# EAGLE schematic Stepoko (EAGLE 6.5.0)

## Sheet 1 of 2
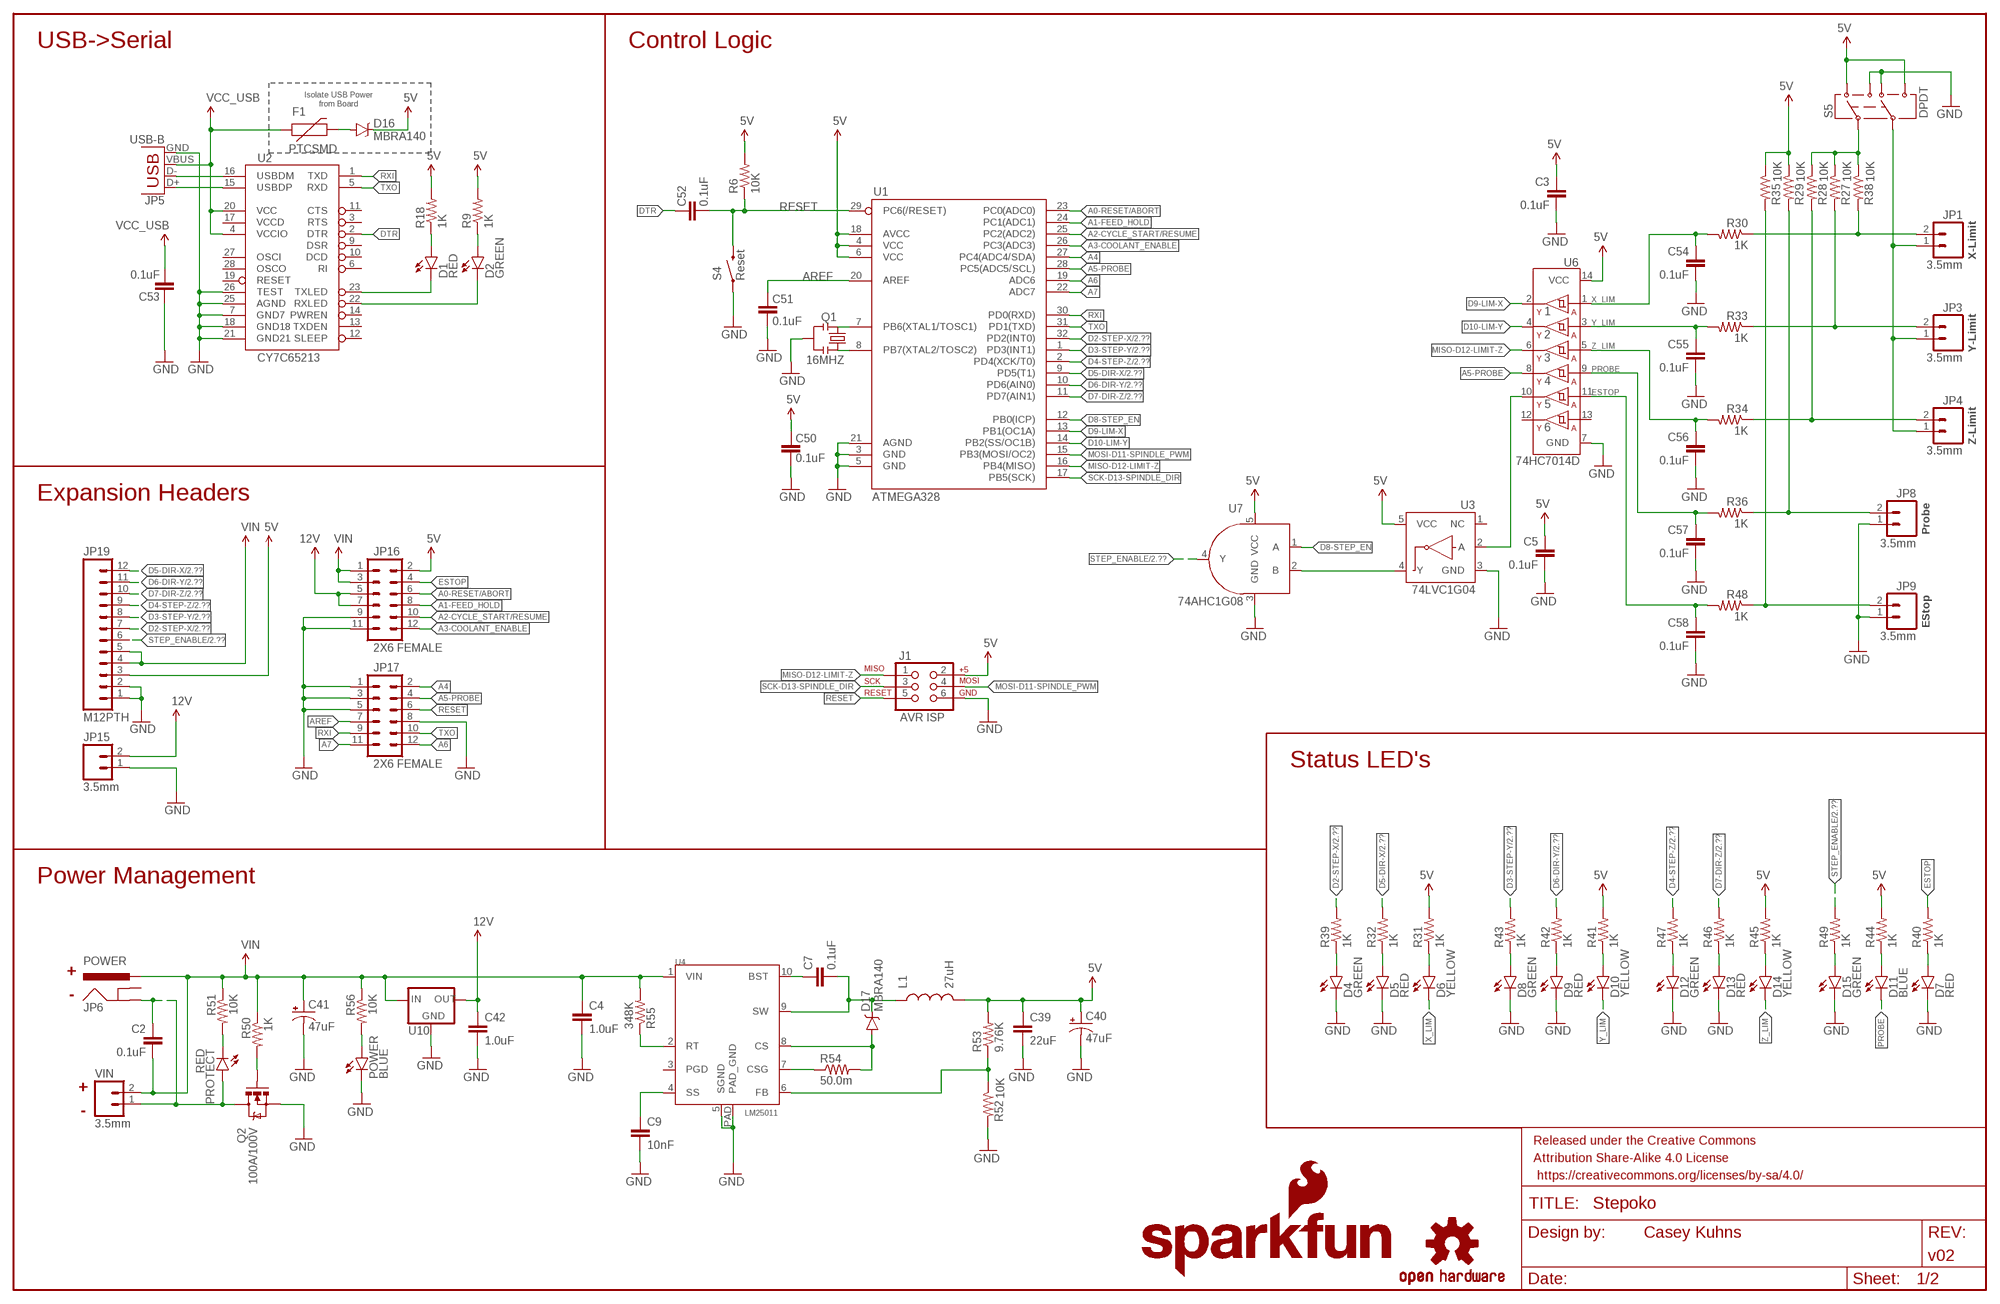
[diagram p0: schematic, sheet 1]

### Parts
C2  0.1uF  0.1UF-100V-10%(0603)  [0603-CAP]
C3  0.1uF  0.1UF-25V(+80/-20%)(0603)  [0603-CAP]
C4  1.0uF  1.0UF50V10%(1206)  [1206]
C5  0.1uF  0.1UF-25V(+80/-20%)(0603)  [0603-CAP]
C7  0.1uF  0.1UF-25V(+80/-20%)(0603)  [0603-CAP]
C9  10nF  10NF/10000PF-50V-10%(0603)  [0603-CAP]
C39  22uF  22UF-16V-20%-(1210)  [1210]
C40  47uF  47UF-50V-20%(ELECT)  [PANASONIC_D]
C41  47uF  47UF-50V-20%(ELECT)  [PANASONIC_D]
C42  1.0uF  1.0UF50V10%(1206)  [1206]
C50  0.1uF  0.1UF-25V(+80/-20%)(0603)  [0603-CAP]
C51  0.1uF  0.1UF-25V(+80/-20%)(0603)  [0603-CAP]
C52  0.1uF  0.1UF-25V(+80/-20%)(0603)  [0603-CAP]
C53  0.1uF  0.1UF-25V(+80/-20%)(0603)  [0603-CAP]
C54  0.1uF  0.1UF-25V(+80/-20%)(0603)  [0603-CAP]
C55  0.1uF  0.1UF-25V(+80/-20%)(0603)  [0603-CAP]
C56  0.1uF  0.1UF-25V(+80/-20%)(0603)  [0603-CAP]
C57  0.1uF  0.1UF-25V(+80/-20%)(0603)  [0603-CAP]
C58  0.1uF  0.1UF-25V(+80/-20%)(0603)  [0603-CAP]
D1  RED  LED-REDLILYPAD  [LED-1206]
D2  GREEN  LED-GREENLILYPAD  [LED-1206]
D4  GREEN  LED-GREENLILYPAD  [LED-1206]
D5  RED  LED-REDLILYPAD  [LED-1206]
D6  YELLOW  LED-YELLOWLILYPAD  [LED-1206]
D7  RED  LED-REDLILYPAD  [LED-1206]
D8  GREEN  LED-GREENLILYPAD  [LED-1206]
D9  RED  LED-REDLILYPAD  [LED-1206]
D10  YELLOW  LED-YELLOWLILYPAD  [LED-1206]
D11  BLUE  LED-BLUE1206  [LED-1206]
D12  GREEN  LED-GREENLILYPAD  [LED-1206]
D13  RED  LED-REDLILYPAD  [LED-1206]
D14  YELLOW  LED-YELLOWLILYPAD  [LED-1206]
D15  GREEN  LED-GREENLILYPAD  [LED-1206]
D16  MBRA140  DIODE-SCHOTTKY-MBRA140  [SMA-DIODE]
D17  MBRA140  DIODE-SCHOTTKY-MBRA140  [SMA-DIODE]
F1  PTCSMD  [PTC-1206]
FRAME1  FRAME-LEDGER  [CREATIVE_COMMONS]
J1  AVR ISP  AVR_SPI_PRG_6PTH  [2X3]
JP1  3.5mm  M023.5MM_LOCK  [SCREWTERMINAL-3.5MM-2_LOCK]
JP3  3.5mm  M023.5MM_LOCK  [SCREWTERMINAL-3.5MM-2_LOCK]
JP4  3.5mm  M023.5MM_LOCK  [SCREWTERMINAL-3.5MM-2_LOCK]
JP5  USB-B  USBPTH  [USB-B-PTH]
JP6  POWER  POWER_JACKPTH_LOCK  [POWER_JACK_PTH_LOCK]
JP8  3.5mm  M023.5MM_LOCK  [SCREWTERMINAL-3.5MM-2_LOCK]
JP9  3.5mm  M023.5MM_LOCK  [SCREWTERMINAL-3.5MM-2_LOCK]
JP15  3.5mm  M023.5MM_LOCK  [SCREWTERMINAL-3.5MM-2_LOCK]
JP16  2X6 FEMALE  M06X2PTH_FEMALE  [2X6]
JP17  2X6 FEMALE  M06X2PTH_FEMALE  [2X6]
JP19  M12PTH  [1X12]
L1  27uH  INDUCTORSDR13-7-270ML  [INDUCTOR_SDR1307]
LOGO1  OSHW-LOGOM  [OSHW-LOGO-M]
LOGO2  SFE_LOGO_NAME_FLAME.2_INCH  [SFE_LOGO_NAME_FLAME_.2]
POWER  BLUE  LED-BLUE1206  [LED-1206]
PROTECT  RED  LED-REDLILYPAD  [LED-1206]
Q1  16MHZ  RESONATOR16MHZ  [RESONATOR-SMD]
Q2  100A/100V  MOSFET-NCHANNELPSMN7R0  [TO-263/D2PAK]
R6  10K  10KOHM-1/10W-1%(0603)0603  [0603-RES]
R9  1K  1KOHM1/10W1%(0603)  [0603-RES]
R18  1K  1KOHM1/10W1%(0603)  [0603-RES]
R27  10K  10KOHM-1/10W-1%(0603)0603  [0603-RES]
R28  10K  10KOHM-1/10W-1%(0603)0603  [0603-RES]
R29  10K  10KOHM-1/10W-1%(0603)0603  [0603-RES]
R30  1K  1KOHM1/10W1%(0603)  [0603-RES]
R31  1K  1KOHM-1/10W-1%(0603)  [0603-RES]
R32  1K  1KOHM-1/10W-1%(0603)  [0603-RES]
R33  1K  1KOHM1/10W1%(0603)  [0603-RES]
R34  1K  1KOHM1/10W1%(0603)  [0603-RES]
R35  10K  10KOHM-1/10W-1%(0603)0603  [0603-RES]
R36  1K  1KOHM1/10W1%(0603)  [0603-RES]
R38  10K  10KOHM-1/10W-1%(0603)0603  [0603-RES]
R39  1K  1KOHM-1/10W-1%(0603)  [0603-RES]
R40  1K  1KOHM-1/10W-1%(0603)  [0603-RES]
R41  1K  1KOHM-1/10W-1%(0603)  [0603-RES]
R42  1K  1KOHM-1/10W-1%(0603)  [0603-RES]
R43  1K  1KOHM-1/10W-1%(0603)  [0603-RES]
R44  1K  1KOHM-1/10W-1%(0603)  [0603-RES]
R45  1K  1KOHM-1/10W-1%(0603)  [0603-RES]
R46  1K  1KOHM-1/10W-1%(0603)  [0603-RES]
R47  1K  1KOHM-1/10W-1%(0603)  [0603-RES]
R48  1K  1KOHM1/10W1%(0603)  [0603-RES]
R49  1K  1KOHM-1/10W-1%(0603)  [0603-RES]
R50  1K  1KOHM1/10W1%(0603)  [0603-RES]
R51  10K  10KOHM-1/10W-1%(0603)0603  [0603-RES]
R52  10K  10KOHM-1/10W-1%(0603)0603  [0603-RES]
R53  9.76K  9.76KOHM-1/10W-1%(0603)  [0603]
R54  50.0m  0.05OHM-1/5W-1%(0603)  [0603]
R55  348K  348KOHM-1/10W-1%(0603)  [0603]
R56  10K  10KOHM-1/10W-1%(0603)0603  [0603-RES]
S4  Reset  SWITCH-MOMENTARY-2SMD  [TACTILE-SWITCH-SMD]
S5  DPDT  SWITCH-DPDTAYZ0202  [AYZ0202]
U1  ATMEGA328  ATMEGA328_SMT  [TQFP32-08]
U2  CY7C65213  [SSOP28DB]
U3  74LVC1G04  INVERTER_SOT353-5  [SOT353]
U4  LM25011  [HVSS0P-10]
U6  74HC7014D  [SOIC-14]
U7  74AHC1G08  [SOT23-5]
U10  V_REG_78XX7812  [TO-252]
VIN  3.5mm  M023.5MM_LOCK  [SCREWTERMINAL-3.5MM-2_LOCK]

### Nets
5V: C3.1 C5.1 C39.1 C40.+ C50.2 D16.C J1.2 JP16.2 JP19.3 L1.P$2 R6.2 R9.2 R18.2 R29.1 R31.2 R35.1 R41.2 R44.2 R45.2 R53.2 S5.1 S5.6 U1.4(VCC) U1.6(VCC) U1.18(AVCC) U3.5(VCC) U6.14(VCC) U7.5(VCC) ; also sheet 2
A0-RESET/ABORT: JP16.6 U1.23(PC0(ADC0))
A1-FEED_HOLD: JP16.8 U1.24(PC1(ADC1))
A2-CYCLE_START/RESUME: JP16.10 U1.25(PC2(ADC2))
A3-COOLANT_ENABLE: JP16.12 U1.26(PC3(ADC3))
A4: JP17.2 U1.27(PC4(ADC4/SDA))
A5-PROBE: JP17.4 U1.28(PC5(ADC5/SCL)) U6.8(4Y)
A6: JP17.12 U1.19(ADC6)
A7: JP17.11 U1.22(ADC7)
AREF: C51.2 JP17.7 U1.20(AREF)
D2-STEP-X: JP19.7 R39.2 U1.32(PD2(INT0)) ; also sheet 2
D3-STEP-Y: JP19.8 R43.2 U1.1(PD3(INT1)) ; also sheet 2
D4-STEP-Z: JP19.9 R47.2 U1.2(PD4(XCK/T0)) ; also sheet 2
D5-DIR-X: JP19.12 R32.2 U1.9(PD5(T1)) ; also sheet 2
D6-DIR-Y: JP19.11 R42.2 U1.10(PD6(AIN0)) ; also sheet 2
D7-DIR-Z: JP19.10 R46.2 U1.11(PD7(AIN1)) ; also sheet 2
D8-STEP_EN: U1.12(PB0(ICP)) U7.1(A)
D9-LIM-X: U1.13(PB1(OC1A)) U6.2(1Y)
D10-LIM-Y: U1.14(PB2(SS/OC1B)) U6.4(2Y)
D+: JP5.D+ U2.15(USBDP)
D-: JP5.D- U2.16(USBDM)
DTR: C52.2 U2.2(DTR)
ESTOP: C58.1 JP16.4 R40.2 R48.2 U6.11(5A)
GND: C3.2 C4.2 C5.2 C9.2 C39.2 C40.- C41.- C42.2 C50.1 C51.1 C53.2 C54.2 C55.2 C56.2 C57.2 C58.2 D4.C D5.C D7.C D8.C D9.C D12.C D13.C D15.C J1.6 JP5.GND JP8.1 JP9.1 JP15.1 JP16.9 JP16.11 JP17.1 JP17.3 JP17.5 JP17.8 JP19.1 JP19.2 POWER.C Q1.2 Q2.3(S) R52.2 S4.1 S5.3 S5.4 U1.3(GND) U1.5(GND) U1.21(AGND) U2.7(GND7) U2.18(GND18) U2.21(GND21) U2.25(AGND) U2.26(TEST) U3.3(GND) U4.5(SGND) U4.PAD(PAD_GND) U6.7(GND) U7.3(GND) U10.3(GND) ; also sheet 2
MISO-D12-LIMIT-Z: J1.1 U1.16(PB4(MISO)) U6.6(3Y)
MOSI-D11-SPINDLE_PWM: J1.4 U1.15(PB3(MOSI/OC2))
N$1: R54.1 U4.7(CSG)
N$2: D2.A R9.1
N$3: D1.A R18.1
N$4: JP1.1 JP3.1 JP4.1 S5.5
N$5: D7.A R40.1
N$6: Q1.3 U1.8(PB7(XTAL2/TOSC2))
N$7: JP1.2 R30.1 R38.2
N$8: Q1.1 U1.7(PB6(XTAL1/TOSC1))
N$13: D11.A R44.1
N$16: D15.A R49.1
N$17: C2.1 JP6.GND PROTECT.A Q2.2(D) VIN.1
N$18: D6.A R31.1
N$19: D5.A R32.1
N$20: D4.A R39.1
N$21: R52.1 R53.1 U4.6(FB)
N$22: D10.A R41.1
N$31: D9.A R42.1
N$32: D1.C U2.23(TXLED)
N$33: D2.C U2.22(RXLED)
N$36: D8.A R43.1
N$39: Q2.1(G) R50.2
N$40: D14.A R45.1
N$41: PROTECT.C R51.2
N$42: JP3.2 R27.2 R33.1
N$43: JP4.2 R28.2 R34.1
N$44: U3.4(Y) U7.2(B)
N$51: D16.A F1.2
N$52: U3.2(A) U6.10(5Y)
N$53: JP8.2 R29.2 R36.1
N$57: JP9.2 R35.2 R48.1
N$62: POWER.A R56.2
N$63: D13.A R46.1
N$64: D12.A R47.1
N$65: D17.A R54.2 U4.8(CS)
N$66: R55.1 U4.2(RT)
N$68: C7.1 U4.10(BST)
N$70: C7.2 D17.C L1.P$1 U4.9(SW)
N$78: C9.1 U4.4(SS)
N$95: R27.1 R28.1 R38.1 S5.2
PROBE: C57.1 D11.C R36.2 U6.9(4A)
RESET: C52.1 J1.5 JP17.6 R6.1 S4.3 U1.29(PC6(/RESET))
RXI: JP17.9 U1.30(PD0(RXD)) U2.1(TXD)
SCK-D13-SPINDLE_DIR: J1.3 U1.17(PB5(SCK))
STEP_ENABLE: JP19.6 R49.2 U7.4(Y) ; also sheet 2
TXO: JP17.10 U1.31(PD1(TXD)) U2.5(RXD)
VCC: C42.1 JP15.2 JP16.5 JP16.7 U10.2(OUT) ; supply symbol labelled 12V
VCC_USB: C53.1 F1.1 JP5.VBUS U2.4(VCCIO) U2.20(VCC)
VIN: C2.2 C4.1 C41.+ JP6.PWR JP16.1 JP16.3 JP19.4 JP19.5 R50.1 R51.1 R55.2 R56.1 U4.1(VIN) U10.1(IN) VIN.2 ; also sheet 2
X_LIM: C54.1 D6.C R30.2 U6.1(1A)
Y_LIM: C55.1 D10.C R33.2 U6.3(2A)
Z_LIM: C56.1 D14.C R34.2 U6.5(3A)
Unconnected: JP6.GNDBREAK U2.3(RTS) U2.6(RI) U2.9(DSR) U2.10(DCD) U2.11(CTS) U2.12(SLEEP) U2.13(TXDEN) U2.14(PWREN) U2.17(VCCD) U2.19(RESET) U2.27(OSCI) U2.28(OSCO) U3.1(NC) U4.3(PGD) U6.12(6Y) U6.13(6A)

### Notes on the sheet
- USB->Serial | Control Logic
- Isolate USB Power
  from Board
- X-Limit
- Y-Limit
- Z-Limit
- Expansion Headers
- Probe
- EStop
- Status LED's
- Power Management
- +
- -
- +
- -

## Sheet 2 of 2
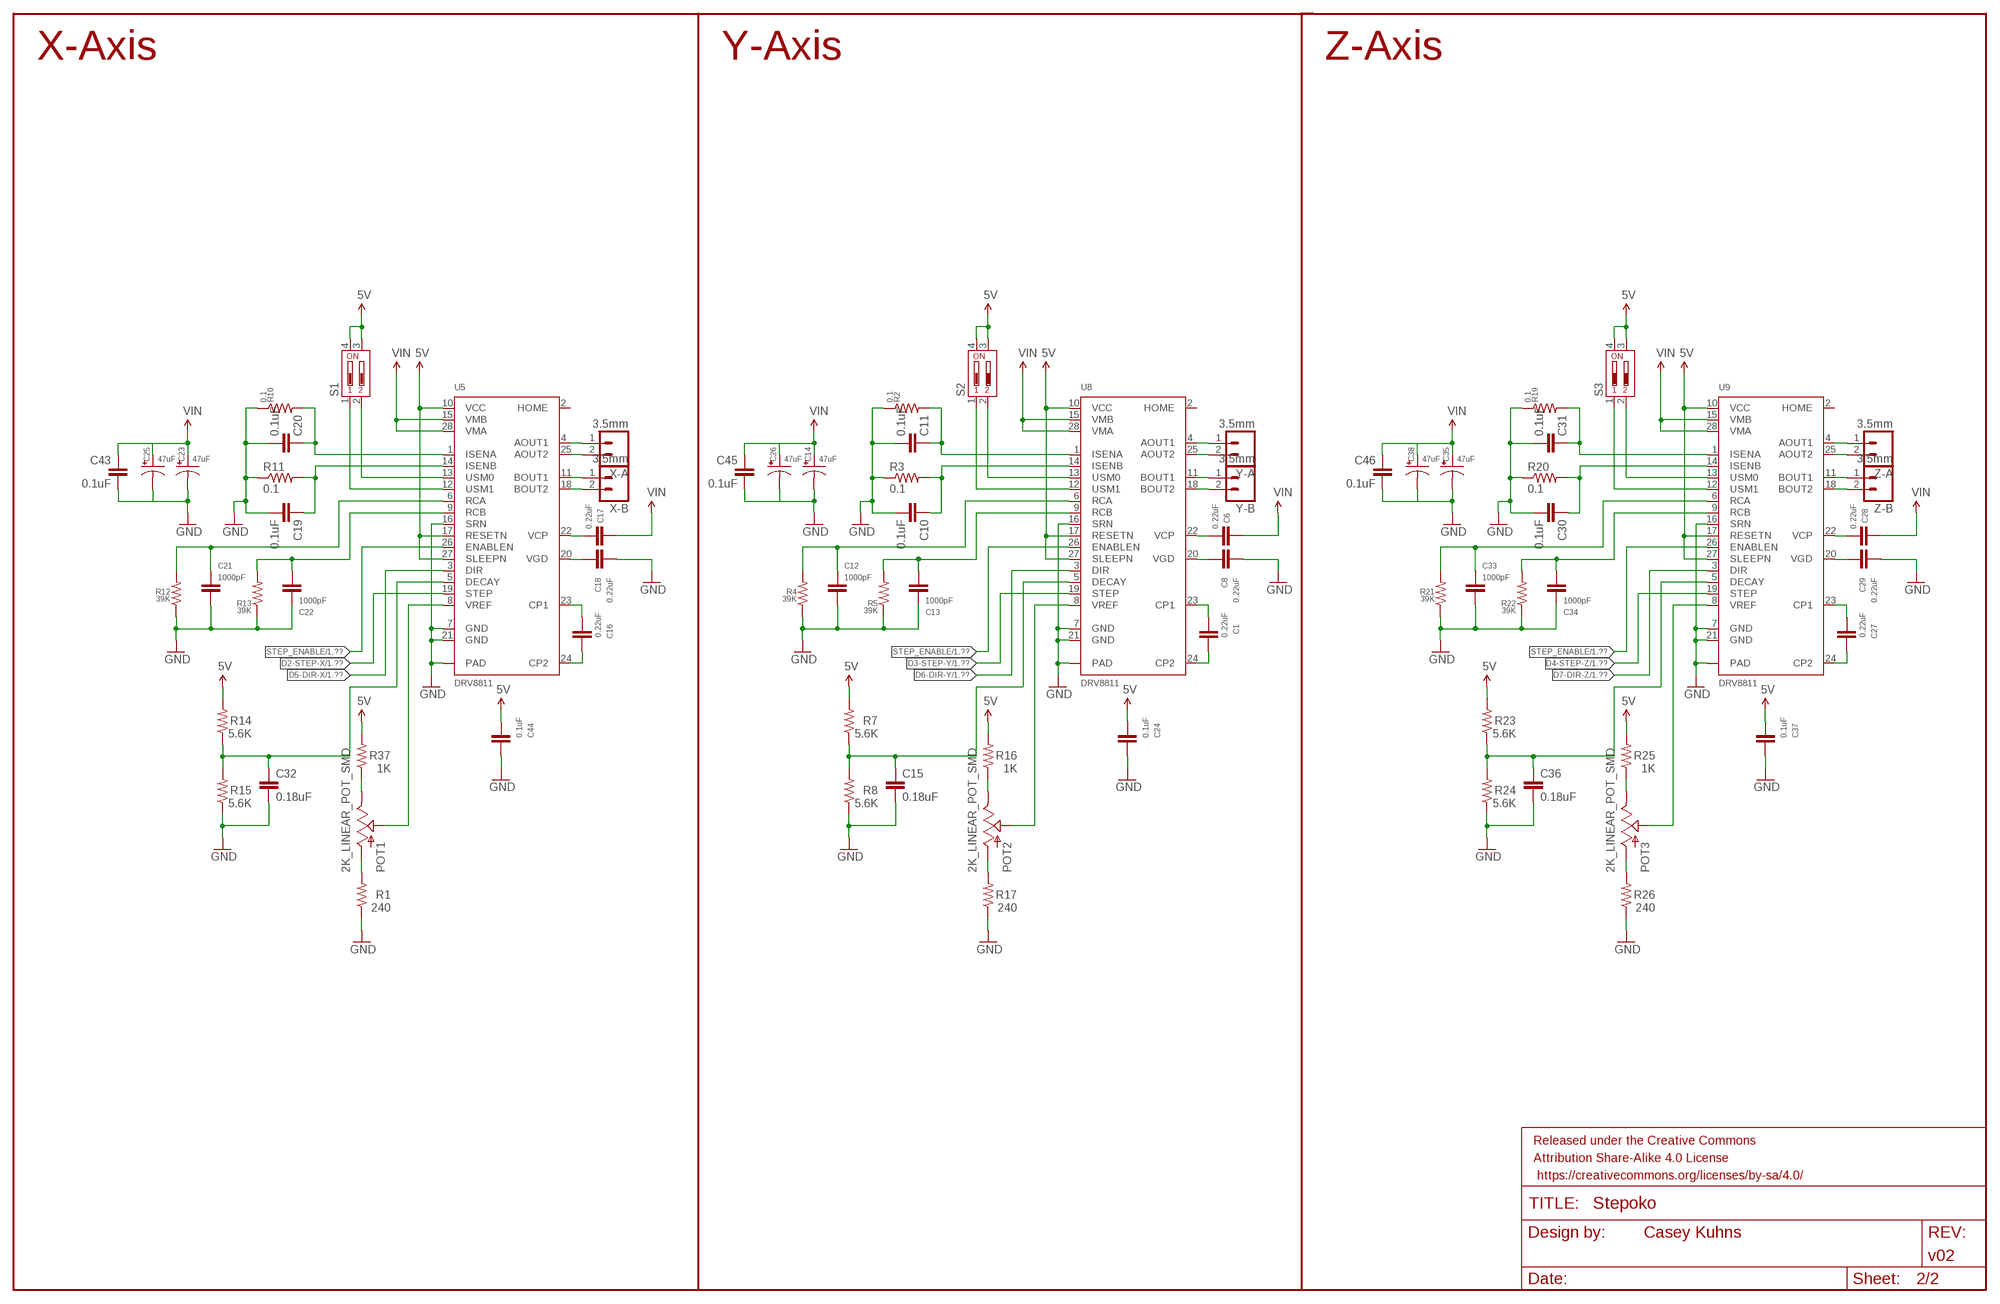
[diagram p1: schematic, sheet 2]

### Parts
C1  0.22uF  0.22UF50V-20%,+80%(0603)  [0603-CAP]
C6  0.22uF  0.22UF50V-20%,+80%(0603)  [0603-CAP]
C8  0.22uF  0.22UF50V-20%,+80%(0603)  [0603-CAP]
C10  0.1uF  0.1UF-25V(+80/-20%)(0603)  [0603-CAP]
C11  0.1uF  0.1UF-25V(+80/-20%)(0603)  [0603-CAP]
C12  1000pF  1NF/1000PF-50V-10%(0603)  [0603-CAP]
C13  1000pF  1NF/1000PF-50V-10%(0603)  [0603-CAP]
C14  47uF  47UF-50V-20%(ELECT)  [PANASONIC_D]
C15  0.18uF  0.18UF-10V(+-10%)(0603)  [0603]
C16  0.22uF  0.22UF50V-20%,+80%(0603)  [0603-CAP]
C17  0.22uF  0.22UF50V-20%,+80%(0603)  [0603-CAP]
C18  0.22uF  0.22UF50V-20%,+80%(0603)  [0603-CAP]
C19  0.1uF  0.1UF-25V(+80/-20%)(0603)  [0603-CAP]
C20  0.1uF  0.1UF-25V(+80/-20%)(0603)  [0603-CAP]
C21  1000pF  1NF/1000PF-50V-10%(0603)  [0603-CAP]
C22  1000pF  1NF/1000PF-50V-10%(0603)  [0603-CAP]
C23  47uF  47UF-50V-20%(ELECT)  [PANASONIC_D]
C24  0.1uF  0.1UF-25V(+80/-20%)(0603)  [0603-CAP]
C25  47uF  47UF-50V-20%(ELECT)  [PANASONIC_D]
C26  47uF  47UF-50V-20%(ELECT)  [PANASONIC_D]
C27  0.22uF  0.22UF50V-20%,+80%(0603)  [0603-CAP]
C28  0.22uF  0.22UF50V-20%,+80%(0603)  [0603-CAP]
C29  0.22uF  0.22UF50V-20%,+80%(0603)  [0603-CAP]
C30  0.1uF  0.1UF-25V(+80/-20%)(0603)  [0603-CAP]
C31  0.1uF  0.1UF-25V(+80/-20%)(0603)  [0603-CAP]
C32  0.18uF  0.18UF-10V(+-10%)(0603)  [0603]
C33  1000pF  1NF/1000PF-50V-10%(0603)  [0603-CAP]
C34  1000pF  1NF/1000PF-50V-10%(0603)  [0603-CAP]
C35  47uF  47UF-50V-20%(ELECT)  [PANASONIC_D]
C36  0.18uF  0.18UF-10V(+-10%)(0603)  [0603]
C37  0.1uF  0.1UF-25V(+80/-20%)(0603)  [0603-CAP]
C38  47uF  47UF-50V-20%(ELECT)  [PANASONIC_D]
C43  0.1uF  0.1UF-25V(+80/-20%)(0603)  [0603-CAP]
C44  0.1uF  0.1UF-25V(+80/-20%)(0603)  [0603-CAP]
C45  0.1uF  0.1UF-25V(+80/-20%)(0603)  [0603-CAP]
C46  0.1uF  0.1UF-25V(+80/-20%)(0603)  [0603-CAP]
FRAME2  FRAME-LEDGER  [CREATIVE_COMMONS]
POT1  2K_LINEAR_POT_SMD  [TC33X]
POT2  2K_LINEAR_POT_SMD  [TC33X]
POT3  2K_LINEAR_POT_SMD  [TC33X]
R1  240  240OHM1/10W1%(0603)  [0603-RES]
R2  0.1  0.1OHM-1/2W-1%(1210)  [1210]
R3  0.1  0.1OHM-1/2W-1%(1210)  [1210]
R4  39K  39KOHM-1/10W-1%(0603)  [0603]
R5  39K  39KOHM-1/10W-1%(0603)  [0603]
R7  5.6K  5.6KOHM-1/10W-1%(0603)  [0603]
R8  5.6K  5.6KOHM-1/10W-1%(0603)  [0603]
R10  0.1  0.1OHM-1/2W-1%(1210)  [1210]
R11  0.1  0.1OHM-1/2W-1%(1210)  [1210]
R12  39K  39KOHM-1/10W-1%(0603)  [0603]
R13  39K  39KOHM-1/10W-1%(0603)  [0603]
R14  5.6K  5.6KOHM-1/10W-1%(0603)  [0603]
R15  5.6K  5.6KOHM-1/10W-1%(0603)  [0603]
R16  1K  1KOHM-1/10W-1%(0603)  [0603-RES]
R17  240  240OHM1/10W1%(0603)  [0603-RES]
R19  0.1  0.1OHM-1/2W-1%(1210)  [1210]
R20  0.1  0.1OHM-1/2W-1%(1210)  [1210]
R21  39K  39KOHM-1/10W-1%(0603)  [0603]
R22  39K  39KOHM-1/10W-1%(0603)  [0603]
R23  5.6K  5.6KOHM-1/10W-1%(0603)  [0603]
R24  5.6K  5.6KOHM-1/10W-1%(0603)  [0603]
R25  1K  1KOHM-1/10W-1%(0603)  [0603-RES]
R26  240  240OHM1/10W1%(0603)  [0603-RES]
R37  1K  1KOHM-1/10W-1%(0603)  [0603-RES]
S1  2-POS-DIPCTS-THRU-HOLE  [209-2LPST]
S2  2-POS-DIPCTS-THRU-HOLE  [209-2LPST]
S3  2-POS-DIPCTS-THRU-HOLE  [209-2LPST]
U5  DRV8811  [HTSSOP28]
U8  DRV8811  [HTSSOP28]
U9  DRV8811  [HTSSOP28]
X-A  3.5mm  M023.5MM_LOCK  [SCREWTERMINAL-3.5MM-2_LOCK]
X-B  3.5mm  M023.5MM_LOCK  [SCREWTERMINAL-3.5MM-2_LOCK]
Y-A  3.5mm  M023.5MM_LOCK  [SCREWTERMINAL-3.5MM-2_LOCK]
Y-B  3.5mm  M023.5MM_LOCK  [SCREWTERMINAL-3.5MM-2_LOCK]
Z-A  3.5mm  M023.5MM_LOCK  [SCREWTERMINAL-3.5MM-2_LOCK]
Z-B  3.5mm  M023.5MM_LOCK  [SCREWTERMINAL-3.5MM-2_LOCK]

### Nets
5V: C24.1 C37.1 C44.1 R7.2 R14.2 R16.2 R23.2 R25.2 R37.2 S1.3 S1.4 S2.3 S2.4 S3.3 S3.4 U5.10(VCC) U5.17(RESETN) U5.27(SLEEPN) U8.10(VCC) U8.17(RESETN) U8.27(SLEEPN) U9.10(VCC) U9.17(RESETN) U9.27(SLEEPN) ; also sheet 1
D2-STEP-X: U5.19(STEP) ; also sheet 1
D3-STEP-Y: U8.19(STEP) ; also sheet 1
D4-STEP-Z: U9.19(STEP) ; also sheet 1
D5-DIR-X: U5.3(DIR) ; also sheet 1
D6-DIR-Y: U8.3(DIR) ; also sheet 1
D7-DIR-Z: U9.3(DIR) ; also sheet 1
GND: C8.1 C10.2 C11.2 C12.2 C13.2 C14.- C15.2 C18.1 C19.2 C20.2 C21.2 C22.2 C23.- C24.2 C25.- C26.- C29.1 C30.2 C31.2 C32.2 C33.2 C34.2 C35.- C36.2 C37.2 C38.- C43.2 C44.2 C45.2 C46.2 R1.1 R2.1 R3.1 R4.1 R5.1 R8.1 R10.1 R11.1 R12.1 R13.1 R15.1 R17.1 R19.1 R20.1 R21.1 R22.1 R24.1 R26.1 U5.7(GND) U5.16(SRN) U5.21(GND) U5.GND@10(PAD) U5.GND@11(PAD) U5.GND@12(PAD) U5.GND@13(PAD) U5.GND@14(PAD) U5.GND@15(PAD) U5.GND@16(PAD) U5.GND@17(PAD) U5.GND@18(PAD) U5.GND@19(PAD) U5.GND@20(PAD) U5.GND@21(PAD) U5.GND@22(PAD) U5.GND@23(PAD) U5.GND@24(PAD) U5.GND@25(PAD) U5.GND@26(PAD) U5.GND@27(PAD) U5.GND@28(PAD) U5.GND@29(PAD) U5.GND@30(PAD) U5.GND@PAD(PAD) U8.7(GND) U8.16(SRN) U8.21(GND) U8.GND@10(PAD) U8.GND@11(PAD) U8.GND@12(PAD) U8.GND@13(PAD) U8.GND@14(PAD) U8.GND@15(PAD) U8.GND@16(PAD) U8.GND@17(PAD) U8.GND@18(PAD) U8.GND@19(PAD) U8.GND@20(PAD) U8.GND@21(PAD) U8.GND@22(PAD) U8.GND@23(PAD) U8.GND@24(PAD) U8.GND@25(PAD) U8.GND@26(PAD) U8.GND@27(PAD) U8.GND@28(PAD) U8.GND@29(PAD) U8.GND@30(PAD) U8.GND@PAD(PAD) U9.7(GND) U9.16(SRN) U9.21(GND) U9.GND@10(PAD) U9.GND@11(PAD) U9.GND@12(PAD) U9.GND@13(PAD) U9.GND@14(PAD) U9.GND@15(PAD) U9.GND@16(PAD) U9.GND@17(PAD) U9.GND@18(PAD) U9.GND@19(PAD) U9.GND@20(PAD) U9.GND@21(PAD) U9.GND@22(PAD) U9.GND@23(PAD) U9.GND@24(PAD) U9.GND@25(PAD) U9.GND@26(PAD) U9.GND@27(PAD) U9.GND@28(PAD) U9.GND@29(PAD) U9.GND@30(PAD) U9.GND@PAD(PAD) ; also sheet 1
N$9: POT1.3(E) R37.1
N$10: POT1.1(A) R1.2
N$11: C12.1 R4.2 U8.6(RCA)
N$12: C13.1 R5.2 U8.9(RCB)
N$14: C15.1 R7.1 R8.2 U8.5(DECAY)
N$15: S2.2 U8.13(USM0)
N$23: S2.1 U8.12(USM1)
N$24: C16.1 U5.24(CP2)
N$25: C16.2 U5.23(CP1)
N$26: C8.2 U8.20(VGD)
N$27: POT2.2(S) U8.8(VREF)
N$28: C21.1 R12.2 U5.6(RCA)
N$29: C22.1 R13.2 U5.9(RCB)
N$30: C32.1 R14.1 R15.2 U5.5(DECAY)
N$34: S1.2 U5.13(USM0)
N$35: S1.1 U5.12(USM1)
N$37: U5.11(BOUT1) X-B.1
N$38: C18.2 U5.20(VGD)
N$45: POT2.3(E) R16.1
N$46: POT2.1(A) R17.2
N$47: C6.2 U8.22(VCP)
N$48: C1.1 U8.24(CP2)
N$49: C1.2 U8.23(CP1)
N$50: U8.11(BOUT1) Y-B.1
N$55: U8.18(BOUT2) Y-B.2
N$56: U8.4(AOUT1) Y-A.1
N$58: U8.25(AOUT2) Y-A.2
N$59: C10.1 R3.2 U8.14(ISENB)
N$67: C17.2 U5.22(VCP)
N$69: U5.18(BOUT2) X-B.2
N$71: U5.4(AOUT1) X-A.1
N$72: C11.1 R2.2 U8.1(ISENA)
N$73: C33.1 R21.2 U9.6(RCA)
N$74: C34.1 R22.2 U9.9(RCB)
N$75: C36.1 R23.1 R24.2 U9.5(DECAY)
N$76: S3.2 U9.13(USM0)
N$77: S3.1 U9.12(USM1)
N$79: U5.25(AOUT2) X-A.2
N$80: C29.2 U9.20(VGD)
N$81: POT3.2(S) U9.8(VREF)
N$82: POT3.3(E) R25.1
N$83: POT3.1(A) R26.2
N$84: C28.2 U9.22(VCP)
N$85: C27.1 U9.24(CP2)
N$86: C27.2 U9.23(CP1)
N$87: U9.11(BOUT1) Z-B.1
N$88: U9.18(BOUT2) Z-B.2
N$89: U9.4(AOUT1) Z-A.1
N$90: U9.25(AOUT2) Z-A.2
N$91: C30.1 R20.2 U9.14(ISENB)
N$92: C19.1 R11.2 U5.14(ISENB)
N$93: C31.1 R19.2 U9.1(ISENA)
N$94: POT1.2(S) U5.8(VREF)
N$96: C20.1 R10.2 U5.1(ISENA)
STEP_ENABLE: U5.26(ENABLEN) U8.26(ENABLEN) U9.26(ENABLEN) ; also sheet 1
VIN: C6.1 C14.+ C17.1 C23.+ C25.+ C26.+ C28.1 C35.+ C38.+ C43.1 C45.1 C46.1 U5.15(VMB) U5.28(VMA) U8.15(VMB) U8.28(VMA) U9.15(VMB) U9.28(VMA) ; also sheet 1
Unconnected: U5.2(HOME) U8.2(HOME) U9.2(HOME)

### Notes on the sheet
- X-Axis | Y-Axis | Z-Axis

## Library data of the parts
C1 C6 C8 C16-C18 C27-C29 = SparkFun-Capacitors:0.22UF50V-20%,+80%(0603): CAP-09885; PROD_ID: CAP-09885
C2 = SparkFun-Capacitors:0.1UF-100V-10%(0603): CAP-08390; PROD_ID: CAP-08390
C3 C5 C7 C10 C11 C19 C20 C24 C30 C31 C37 C43-C46 C50-C58 = SparkFun-Capacitors:0.1UF-25V(+80/-20%)(0603): CAP-00810 Ceramic Standard decoupling cap; PROD_ID: CAP-00810
C4 C42 = SparkFun-Capacitors:1.0UF50V10%(1206): CAP-09822; PROD_ID: CAP-09822
C9 = SparkFun-Capacitors:10NF/10000PF-50V-10%(0603): CAP-00867; PROD_ID: CAP-00867
C12 C13 C21 C22 C33 C34 = SparkFun-Capacitors:1NF/1000PF-50V-10%(0603): CAP-07886; PROD_ID: CAP-07886; VALUE: 1nF
C14 C23 C25 C26 C35 C38 C40 C41 = SparkFun-Capacitors:47UF-50V-20%(ELECT): CAP-10547; PROD_ID: CAP-10547
C15 C32 C36 = SparkFun-Capacitors:0.18UF-10V(+-10%)(0603); PROD_ID: CAP-12380
C39 = SparkFun-Capacitors:22UF-16V-20%-(1210): CAP-10381; PROD_ID: CAP-10381
D1 D5 D7 D9 D13 PROTECT = SparkFun-LED:LED-RED: Assorted Red LEDs LilyPad 1206- DIO-09912 1206- DIO-00809 0603- DIO-00819; PROD_ID: DIO-09912
D2 D4 D8 D12 D15 = SparkFun-LED:LED-GREEN: Various green LEDs Green LEDs used in SFE Production 0603- DIO-00821 LARGE- DIO-00862 LILYPAD- DIO-09910; PROD_ID: DIO-09910
D6 D10 D14 = SparkFun-LED:LED-YELLOW: Yellow SMD LEDs LilyPad 1206- DIO-09909 0603- DIO-09003; PROD_ID: DIO-09909; VALUE: Yellow
D11 POWER = SparkFun-LED:LED-BLUE: Blue LEDs for production use Various blue LEDs stocked by SparkFun production 0603 - DIO-08575 Rebel - DIO-09553 1206 - DIO-09911; PROD_ID: DIO-09911
D16 D17 = SparkFun-DiscreteSemi:DIODE-SCHOTTKY: Schottky diodes in SFE's production catalog BAT20J 1A 23V 0.62Vf RB751 120mA 40V 0.37Vf PMEG4005EJ 0.5A 40V 0.42Vf MBRA140 1A 40V 0.5Vf B340A 3A 40V SMA; PROD_ID: DIO-08053
F1 = SparkFun-PowerIC:PTC: Resettable Fuse PTC Resettable Fuse. Spark Fun Electronics SKU : COM-08357; PROD_ID: RES-11150
FRAME1 FRAME2 = SparkFun-Aesthetics:FRAME-LEDGER: Schematic Frame Standard 11x14 US Ledger frame; DESIGNER: Casey Kuhns; VERSION: v02
J1 = SparkFun-Connectors:AVR_SPI_PRG_6: AVR ISP 6 Pin This is the reduced ISP connector for AVR programming. Common on Arduino. This footprint will take up less PCB space and can be used with a 10-pin to 6-pin adapter such as SKU: BOB-08508 **Special note about "TEST_POINT" package. The stop mask is on the top side, so if you want your programming test points to be on the bottom of your board, make sure to place this package on the bottom side of the board. This also ensure that the orientation to program from the bottom side will be correct.
JP1 JP3 JP4 JP8 JP9 JP15 VIN X-A X-B Y-A Y-B Z-A Z-B = SparkFun-Connectors:M02: Standard 2-pin 0.1" header. Use with - straight break away headers ( PRT-00116) - right angle break away headers (PRT-00553) - swiss pins (PRT-00743) - machine pins (PRT-00117) - female headers (PRT-00115) Molex polarized connector foot print use with: PRT-08233 with associated crimp pins and housings. 2.54_SCREWTERM for use with PRT-10571. 3.5mm Screw Terminal footprints for PRT-08084 5mm Screw Terminal footprints for use with PRT-08432; PROD_ID: CONN-08399
JP5 = SparkFun-Connectors:USB: USB Connectors USB-B-PTH is fully proven SKU : PRT-00139/CONN-08278 USB-miniB is fully proven SKU : PRT-00587 USB-A-PCB is untested. USB-A-H is throughly reviewed, but untested. Spark Fun Electronics SKU : PRT-00437 USB-B-SMT is throughly reviewed, but untested. Needs silkscreen touching up. USB-A-S has not been used/tested USB-MB-H has not been used/tested USB-MICROB has been used. CONN-09505; PROD_ID: CONN-08278
JP6 = SparkFun-Connectors:POWER_JACK: Power Jack This is the standard 5.5mm barrel jack for power. The PTH is the most common, proven, reliable, footprint. The Slot footprint only works if the mill layer is transmitted to the PCB fab house so be warned. Mating wall wart : TOL-00298 (and others); PROD_ID: CONN-08197; SF_ID: PRT-00119
JP16 JP17 = SparkFun-Connectors:M06X2; PROD_ID: CONN-12423
JP19 = SparkFun-Connectors:M12: Header 12 Standard 12-pin 0.1" header. Use with straight break away headers (SKU : PRT-00116), right angle break away headers (PRT-00553), swiss pins (PRT-00743), machine pins (PRT-00117), and female headers (PRT-00115).
L1 = SparkFun-Passives:INDUCTOR: Inductors Basic Inductor/Choke - 0603 and 1206. Footprints are not proven and vary greatly between part numbers. SRN6045- 33uH, 20% 1.4A SDR0403-560KL - 56uH, 10%, 500mA RMS/740mA peak; PROD_ID: NDUC-12529
LOGO1 = SparkFun-Aesthetics:OSHW-LOGO: Open Source Hardware Logo This logo indicates the piece of hardware it is found on incorporates a OSHW license and/or adheres to the definition of open source hardware found here: http://freedomdefined.org/OSHW
LOGO2 = SparkFun-Aesthetics:SFE_LOGO_NAME_FLAME: SFE Logo, name and flame This is the SparkFun full logo. The logo on the schematic will always be the same size; the package variant is the height of the flame part of the logo. Default layer for the logo on the board is tSilk.
POT1-POT3 = SparkFun-Resistors:2K_LINEAR_POT_SMD; PROD_ID: RES-12428
Q1 = SparkFun-FreqCtrl:RESONATOR: Resonator Small SMD resonator. Used, eg, on the Arduino Pro/ Pro Mini boards. 8MHz- XTAL-08895 16MHz- XTAL-08900; PROD_ID: XTAL-08900
Q2 = SparkFun-DiscreteSemi:MOSFET-NCHANNEL: Common NMOSFET Parts MFG P/N Store ID Prod ID FDD8780 TRANS-09984 SI7820DN TRANS-11055 FDS6630A IC-08089 2N7002PW TRANS-11151 FQP30N06L COM-10213 TRANS-10060 BSS123LT1G TRANS-08345 BSS138 TRANS-00830 BS170 2N7000; PROD_ID: TRANS-12437
R1 R17 R26 = SparkFun-Resistors:240OHM1/10W1%(0603): RES-07849; PROD_ID: RES-07849
R2 R3 R10 R11 R19 R20 = SparkFun-Resistors:0.1OHM-1/2W-1%(1210); PROD_ID: RES-12374
R4 R5 R12 R13 R21 R22 = SparkFun-Resistors:39KOHM-1/10W-1%(0603); PROD_ID: RES-12377
R6 R27-R29 R35 R38 R51 R52 R56 = SparkFun-Resistors:10KOHM-1/10W-1%(0603): RES-00824; PROD_ID: RES-00824
R7 R8 R14 R15 R23 R24 = SparkFun-Resistors:5.6KOHM-1/10W-1%(0603); PROD_ID: RES-12378
R9 R18 R30 R33 R34 R36 R48 R50 = SparkFun-Resistors:1KOHM1/10W1%(0603): RES-07856; PROD_ID: RES-07856
R16 R25 R31 R32 R37 R39-R47 R49 = SparkFun-Resistors:1KOHM-1/10W-1%(0603): RES-07856; PROD_ID: RES-07856
R53 = SparkFun-Resistors:9.76KOHM-1/10W-1%(0603); PROD_ID: RES-12534
R54 = SparkFun-Resistors:0.05OHM-1/5W-1%(0603); PROD_ID: RES-12535
R55 = SparkFun-Resistors:348KOHM-1/10W-1%(0603); PROD_ID: RES-12533
S1-S3 = SparkFun-Electromechanical:2-POS-DIP: SMD dip switch 2 positions; PROD_ID: SWCH-12532
S4 = SparkFun-Electromechanical:SWITCH-MOMENTARY-2: Various NO switches- pushbuttons, reed, etc; PROD_ID: SWCH-08247
S5 = SparkFun-Electromechanical:SWITCH-DPDT: DPDT Version of the COM-00597; PROD_ID: SWCH-08179
U1 = SparkFun-DigitalIC:ATMEGA328_SMT: 32-Pin Atmega328 part Commonly used on Arduino compatible boards Available in QFP and QFN packages TQFP is IC-09069 QFN is non-stock; PROD_ID: IC-09069; VALUE: ATMEGA328P
U2 = SparkFun-DigitalIC:CY7C65213: USB UART CY7C65213 USB-UART controller.; PROD_ID: IC-12487
U3 = SparkFun-DigitalIC:INVERTER: Single inverter, SOT23-5; PROD_ID: IC-10843
U4 = SparkFun-PowerIC:LM25011: The LM25011 constant on-time step-down switching regulator features all the functions needed to implement a low-cost, efficient, buck bias regulator capable of supplying up to 2 A of load current. This high-voltage regulator contains an N-Channel Buck switch, a startup regulator, current limit detection, and internal ripple control.; PROD_ID: IC-12528
U5 U8 U9 = SparkFun-PowerIC:DRV8811; PROD_ID: IC-12375
U6 = SparkFun-DigitalIC:74HC7014D: The 74HC7014 is a hex buffer with precision Schmitt-trigger inputs. The precisely defined trigger levels are lying in a window between (0.55 x VCC) and (0.65 x VCC). It makes the circuit suitable to operate in a highly noisy environment. Input shorts are allowed to -1.5 V and +16 V without disturbing other channels. Inputs include clamp diodes that enable the use of current limiting resistors to interface inputs to voltages in excess of VCC. Schmitt trigger inputs transform slowly changing input signals into sharply defined jitter-free output signals.; PROD_ID: IC-12527
U7 = SparkFun-DigitalIC:74AHC1G08: Single 2-input AND gate; PROD_ID: IC-10841
U10 = SparkFun-PowerIC:V_REG_78XX: Voltage Regulator Standard 78xx regulator. IGO (Input Ground Output). Spark Fun Electronics SKU : COM-00107; PROD_ID: VREG-12370; VALUE: +12v